# Altium project NanoEEG_1v1_ADC.PrjPCB
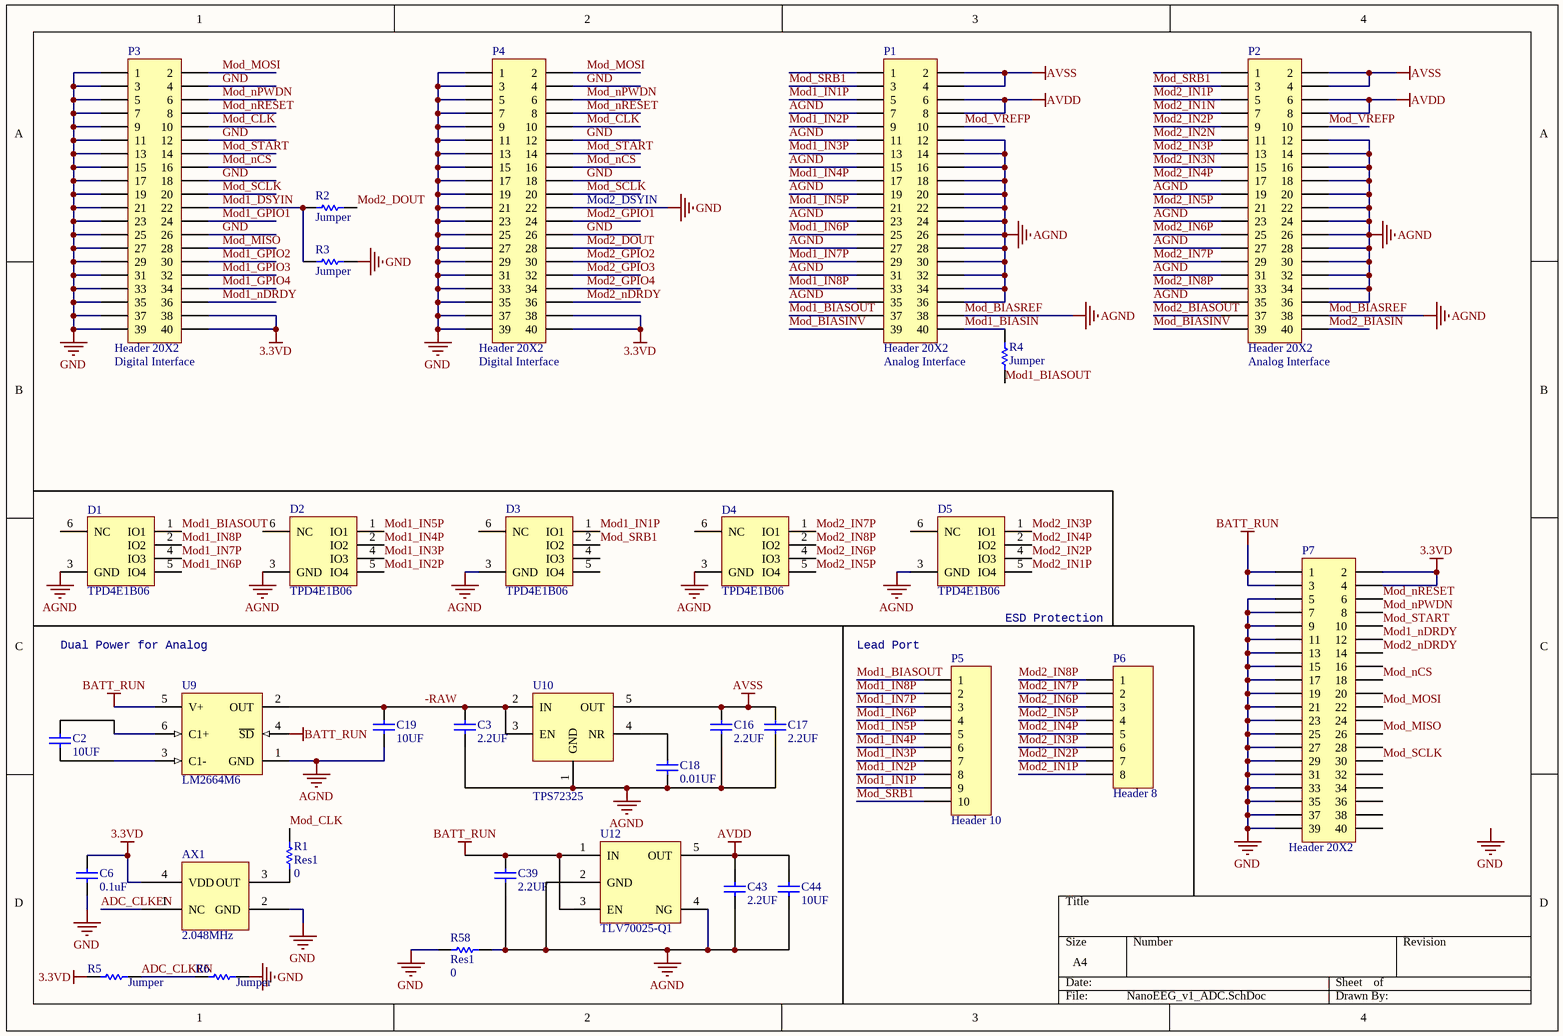
[diagram p0: NanoEEG_v1_ADC.SchDoc]
1 sheet, 33 parts. Net scope: global (net labels, ports and power ports of the same name join across sheets).
Board file: NanoEEG_1v1_ADC.PcbDoc

## Sheet NanoEEG_v1_ADC.SchDoc
size A4

### Parts
AX1  2.048MHz  [EPSON-SG-310-4_V]
C2  10UF  [RESC2012N]
C3  2.2UF  [RESC2012N]
C6  0.1uF  [RESC1608N]
C16  2.2UF  [RESC1608N]
C17  2.2UF  [RESC1608N]
C18  0.01UF  [RESC1608N]
C19  10UF  [RESC2012N]
C39  2.2UF  [RESC2012N]
C43  2.2UF  [RESC2012N]
C44  10UF  [RESC2012N]
D1  TPD4E1B06  [erjiguan]
D2  TPD4E1B06  [erjiguan]
D3  TPD4E1B06  [erjiguan]
D4  TPD4E1B06  [erjiguan]
D5  TPD4E1B06  [erjiguan]
P1  Header 20X2  [FCI-B2B-0.8mm-40p-male]
P2  Header 20X2  [FCI-B2B-0.8mm-40p-MALE]
P3  Header 20X2  [FCI-B2B-0.8mm-40p-male]
P4  Header 20X2  [FCI-B2B-0.8mm-40p-MALE]
P5  Header 10  [PH2.0-WS-10P]
P6  Header 8  [PH2.0-WS-8P]
P7  Header 20X2  [FCI-B2B-0.8mm-40p-MALE]
R1  Res1  value 0  [RESC1608N]
R2  Jumper  [RESC0603(1608)_N]
R3  Jumper  [RESC0603(1608)_N]
R4  Jumper  [RESC0603(1608)_N]
R5  Jumper  [RESC0603(1608)_N]
R6  Jumper  [RESC0603(1608)_N]
R58  Res1  value 0  [RESC3225N]
U9  LM2664M6  [DBV0006A_N]
U10  TPS72325  [SOT23_5]
U12  TLV70025-Q1  [SOT23_5]

### Nets
3.3VD: AX1.4(VDD) C6.1 P3.38 P3.40 P4.38 P4.40 P7.2 P7.4 R5.1
AGND: C3.1 C16.1 C17.1 C18.1 C19.1 C39.1 C43.1 C44.1 D1.3(GND) D2.3(GND) D3.3(GND) D4.3(GND) D5.3(GND) P1.7 P1.11 P1.12 P1.14 P1.15 P1.16 P1.18 P1.19 P1.20 P1.22 P1.23 P1.24 P1.26 P1.27 P1.28 P1.30 P1.31 P1.32 P1.34 P1.35 P1.36 P1.38 P2.12 P2.14 P2.16 P2.18 P2.19 P2.20 P2.22 P2.23 P2.24 P2.26 P2.27 P2.28 P2.30 P2.31 P2.32 P2.34 P2.35 P2.36 P2.38 R58.1 U9.1(GND) U10.1(GND) U12.2(GND) U12.4(NG)  [also labelled Mod_BIASREF]
AVDD: C43.2 C44.2 P1.6 P1.8 P2.6 P2.8 U12.5(OUT)
AVSS: C16.2 C17.2 P1.2 P1.4 P2.2 P2.4 U10.5(OUT)
BATT_RUN: C39.2 P7.1 P7.3 U9.4(~{SD}) U9.5(V+) U12.1(IN) U12.3(EN)
GND: AX1.2(GND) C6.2 P3.1 P3.3 P3.4 P3.5 P3.7 P3.9 P3.11 P3.12 P3.13 P3.15 P3.17 P3.18 P3.19 P3.21 P3.23 P3.25 P3.26 P3.27 P3.29 P3.31 P3.33 P3.35 P3.37 P3.39 P4.1 P4.3 P4.4 P4.5 P4.7 P4.9 P4.11 P4.12 P4.13 P4.15 P4.17 P4.18 P4.19 P4.21 P4.22 P4.23 P4.25 P4.26 P4.27 P4.29 P4.31 P4.33 P4.35 P4.37 P4.39 P7.5 P7.7 P7.9 P7.11 P7.13 P7.15 P7.17 P7.19 P7.21 P7.23 P7.25 P7.27 P7.29 P7.31 P7.33 P7.35 P7.37 P7.39 R3.2 R6.2 R58.2
-RAW: C3.2 C19.2 U9.2(OUT) U10.2(IN) U10.3(EN)
ADC_CLKEN: AX1.1(NC) R5.2 R6.1
Mod1_BIASIN: P1.40 R4.1
Mod1_BIASOUT: D1.1(IO1) P1.37 P5.1 R4.2
Mod1_DSYIN: P3.22 R2.1 R3.1
Mod1_GPIO1: P3.24
Mod1_GPIO2: P3.30
Mod1_GPIO3: P3.32
Mod1_GPIO4: P3.34
Mod1_IN1P: D3.1(IO1) P1.5 P5.9
Mod1_IN2P: D2.5(IO4) P1.9 P5.8
Mod1_IN3P: D2.4(IO3) P1.13 P5.7
Mod1_IN4P: D2.2(IO2) P1.17 P5.6
Mod1_IN5P: D2.1(IO1) P1.21 P5.5
Mod1_IN6P: D1.5(IO4) P1.25 P5.4
Mod1_IN7P: D1.4(IO3) P1.29 P5.3
Mod1_IN8P: D1.2(IO2) P1.33 P5.2
Mod1_nDRDY: P3.36 P7.12
Mod2_BIASIN: P2.40
Mod2_BIASOUT: P2.37
Mod2_DOUT: P4.28 R2.2
Mod2_GPIO1: P4.24
Mod2_GPIO2: P4.30
Mod2_GPIO3: P4.32
Mod2_GPIO4: P4.34
Mod2_IN1N: P2.7
Mod2_IN1P: D5.5(IO4) P2.5 P6.8
Mod2_IN2N: P2.11
Mod2_IN2P: D5.4(IO3) P2.9 P6.7
Mod2_IN3N: P2.15
Mod2_IN3P: D5.1(IO1) P2.13 P6.6
Mod2_IN4P: D5.2(IO2) P2.17 P6.5
Mod2_IN5P: D4.5(IO4) P2.21 P6.4
Mod2_IN6P: D4.4(IO3) P2.25 P6.3
Mod2_IN7P: D4.1(IO1) P2.29 P6.2
Mod2_IN8P: D4.2(IO2) P2.33 P6.1
Mod2_nDRDY: P4.36 P7.14
Mod_BIASINV: P1.39 P2.39
Mod_CLK: P3.10 P4.10 R1.2
Mod_MISO: P3.28 P7.26
Mod_MOSI: P3.2 P4.2 P7.22
Mod_nCS: P3.16 P4.16 P7.18
Mod_nPWDN: P3.6 P4.6 P7.8
Mod_nRESET: P3.8 P4.8 P7.6
Mod_SCLK: P3.20 P4.20 P7.30
Mod_SRB1: D3.2(IO2) P1.3 P2.3 P5.10
Mod_START: P3.14 P4.14 P7.10
Mod_VREFP: P1.10 P2.10
NetAX1_3: AX1.3(OUT) R1.1
NetC2_1: C2.1 U9.3(C1-)
NetC2_2: C2.2 U9.6(C1+)
NetC18_2: C18.2 U10.4(NR)

Not connected (* = marked no-connect by the designer): D1 6(NC); D2 6(NC); D3 4(IO3) 5(IO4) 6(NC); D4 6(NC); D5 6(NC); P1 1; P2 1; P7 16 20 24 28 32 34 36 38 40

### Notes on the sheet
- (near P4) Mod2_DSYIN
- (near P3) Digital Interface
- (near P4) Digital Interface
- Analog Interface
- (near P2) Analog Interface
- Dual Power for Analog
- Lead Port
- ESD Protection
- Labels drawn without touching a wire or pin: GND

### Library data of the parts
AX1 = Active Cyrstal 5x7
C2 C19 C44 = CAP_0603
C3 C16-C18 C39 C43 = CAP_0402
C6 = 电容
P1-P4 P7 = Header 20X2: Header, 20-Pin, Dual row; LatestRevisionDate: 17-Jul-2002; LatestRevisionNote: Re-released for DXP Platform.; Publisher: Altium Limited
P5 = Header 10: Header, 10-Pin; LatestRevisionDate: 17-Jul-2002; LatestRevisionNote: Re-released for DXP Platform.; Publisher: Altium Limited
P6 = Header 8: Header, 8-Pin; LatestRevisionDate: 17-Jul-2002; LatestRevisionNote: Re-released for DXP Platform.; Publisher: Altium Limited
R1 R58 = Res1: Resistor; Published: 8-Jun-2000; LatestRevisionDate: 17-Jul-2002; LatestRevisionNote: Re-released for DXP Platform.; PackageReference: AXIAL-0.3; Publisher: Altium Limited; PackageDescription: Axial Device, Thru-Hole; 2 Leads; 0.3 in Pin Spacing
R2-R6 = CMP-1012-00001-1: Jumper 0603 (1608 Metric); Case-Metric: 1608; Value: 0.00 Ohm; Power: None; Case-EIA: 0603; Technology: SMT; Tolerance: None
U9 = CMP-0065-00095-3: Switched Capacitor Voltage Converter, 6-pin SOT-23; Manufacturer: Texas Instruments; CompType: Switch Caps; PackageTopMarking: S03A*XTT; PowerWise: N; PackageDescription: Molded SOT-23, .115 x .063 x .040in Body, 6 Lead, .0375in in Pitch; Code_IPC: SOT26A-6; PinCount: 6; PackageReference: DBV0006A; ComponentLink1URL: http://www.ti.com/general/docs/lit/getliterature.tsp?genericPartNumber=LM2664&fileType=pdf; Code_JEDEC: MO-178-AB; ComponentLink1Description: Datasheet URL; RoHS: N
U10 = TPS72325: -2.5V